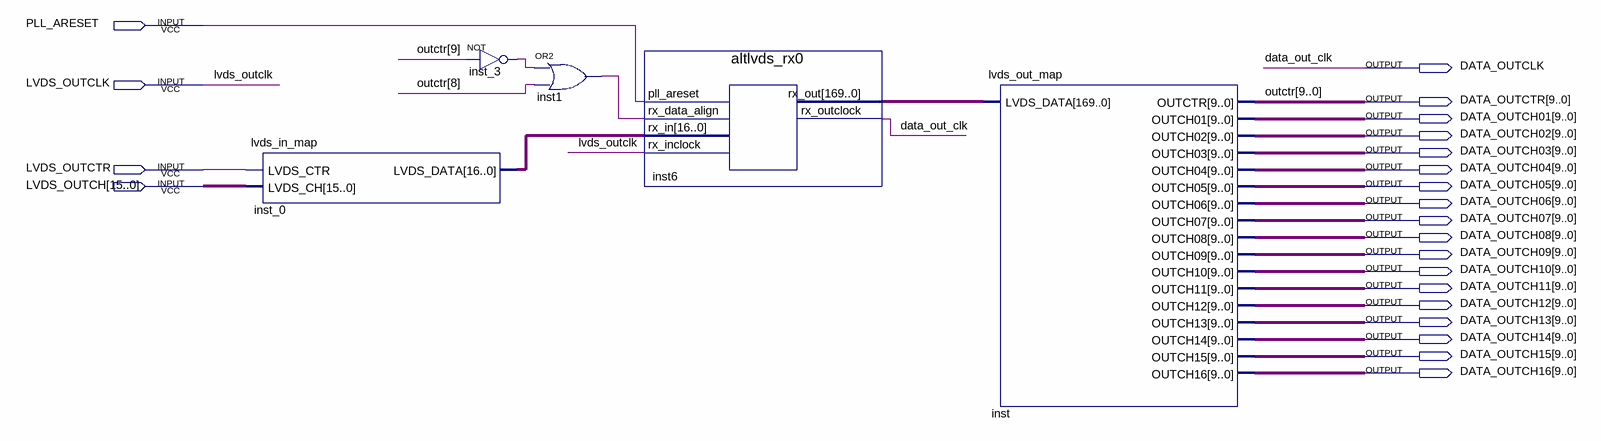
[diagram p0: schematic sheet]
// Quartus schematic lvds_decoder.bdf as structural Verilog: 5 symbols, 22 pins
module lvds_decoder (
  input  PLL_ARESET,
  input  LVDS_OUTCLK,
  input  LVDS_OUTCTR,
  input  [15:0] LVDS_OUTCH,
  output DATA_OUTCLK,
  output [9:0] DATA_OUTCTR,
  output [9:0] DATA_OUTCH01,
  output [9:0] DATA_OUTCH02,
  output [9:0] DATA_OUTCH03,
  output [9:0] DATA_OUTCH04,
  output [9:0] DATA_OUTCH05,
  output [9:0] DATA_OUTCH06,
  output [9:0] DATA_OUTCH07,
  output [9:0] DATA_OUTCH08,
  output [9:0] DATA_OUTCH09,
  output [9:0] DATA_OUTCH10,
  output [9:0] DATA_OUTCH11,
  output [9:0] DATA_OUTCH12,
  output [9:0] DATA_OUTCH13,
  output [9:0] DATA_OUTCH14,
  output [9:0] DATA_OUTCH15,
  output [9:0] DATA_OUTCH16
);

  wire inst1_out, inst_3_out;
  wire [16:0] inst_0_lvds_data;
  wire [169:0] inst6_rx_out;

  lvds_in_map inst_0 (.LVDS_CTR(LVDS_OUTCTR), .LVDS_CH(LVDS_OUTCH), .LVDS_DATA(inst_0_lvds_data));
  not inst_3 (inst_3_out, DATA_OUTCTR[9]);
  or inst1 (inst1_out, inst_3_out, DATA_OUTCTR[8]);
  altlvds_rx0 inst6 (
    .pll_areset(PLL_ARESET), .rx_data_align(inst1_out), .rx_in(inst_0_lvds_data), .rx_inclock(LVDS_OUTCLK),
    .rx_out(inst6_rx_out), .rx_outclock(DATA_OUTCLK));
  lvds_out_map inst (
    .LVDS_DATA(inst6_rx_out), .OUTCTR(DATA_OUTCTR), .OUTCH01(DATA_OUTCH01), .OUTCH02(DATA_OUTCH02),
    .OUTCH03(DATA_OUTCH03), .OUTCH04(DATA_OUTCH04), .OUTCH05(DATA_OUTCH05), .OUTCH06(DATA_OUTCH06),
    .OUTCH07(DATA_OUTCH07), .OUTCH08(DATA_OUTCH08), .OUTCH09(DATA_OUTCH09), .OUTCH10(DATA_OUTCH10),
    .OUTCH11(DATA_OUTCH11), .OUTCH12(DATA_OUTCH12), .OUTCH13(DATA_OUTCH13), .OUTCH14(DATA_OUTCH14),
    .OUTCH15(DATA_OUTCH15), .OUTCH16(DATA_OUTCH16));

  // Other names for the same wires on the sheet: data_out_clk = DATA_OUTCLK; outctr[9:0] = DATA_OUTCTR
endmodule
